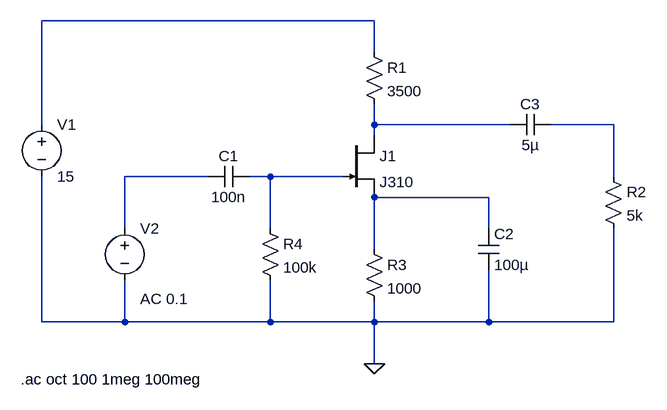
[diagram p0: schematic NJ.asc]
NJ.asc, the LTspice schematic file:
Version 4.1
SHEET 1 880 680
WIRE 240 -16 -272 -16
WIRE 240 32 240 -16
WIRE -272 144 -272 -16
WIRE 240 144 240 112
WIRE 448 144 240 144
WIRE 608 144 512 144
WIRE 240 160 240 144
WIRE -16 224 -144 224
WIRE 80 224 48 224
WIRE 192 224 80 224
WIRE 608 224 608 144
WIRE 416 256 240 256
WIRE -144 304 -144 224
WIRE 80 304 80 224
WIRE 416 304 416 256
WIRE 240 336 240 256
WIRE -272 448 -272 224
WIRE -144 448 -144 384
WIRE -144 448 -272 448
WIRE 80 448 80 384
WIRE 80 448 -144 448
WIRE 240 448 240 416
WIRE 240 448 80 448
WIRE 416 448 416 368
WIRE 416 448 240 448
WIRE 608 448 608 304
WIRE 608 448 416 448
WIRE 240 512 240 448
FLAG 240 512 0
SYMBOL res 224 16 R0
SYMATTR InstName R1
SYMATTR Value 3500
SYMBOL res 592 208 R0
SYMATTR InstName R2
SYMATTR Value 5k
SYMBOL res 224 320 R0
SYMATTR InstName R3
SYMATTR Value 1000
SYMBOL res 64 288 R0
SYMATTR InstName R4
SYMATTR Value 100k
SYMBOL voltage -272 128 R0
WINDOW 123 0 0 Left 0
WINDOW 39 0 0 Left 0
SYMATTR InstName V1
SYMATTR Value 15
SYMBOL voltage -144 288 R0
WINDOW 123 24 124 Left 2
WINDOW 39 0 0 Left 0
SYMATTR InstName V2
SYMATTR Value ""
SYMATTR Value2 AC 0.1
SYMBOL cap 48 208 R90
WINDOW 0 0 32 VBottom 2
WINDOW 3 32 32 VTop 2
SYMATTR InstName C1
SYMATTR Value 100n
SYMBOL cap 400 304 R0
SYMATTR InstName C2
SYMATTR Value 100µ
SYMBOL cap 512 128 R90
WINDOW 0 0 32 VBottom 2
WINDOW 3 32 32 VTop 2
SYMATTR InstName C3
SYMATTR Value 5µ
SYMBOL njf 192 160 R0
SYMATTR InstName J1
SYMATTR Value J310
TEXT -304 536 Left 2 !.ac oct 100 1meg 100meg

The netlist it stands for:
* NJ.asc
R1 N001 N002 3500
R2 N003 0 5k
R3 N006 0 1000
R4 N005 0 100k
V1 N001 0 15
V2 N004 0 AC 0.1
C1 N005 N004 100n
C2 N006 0 100µ
C3 N003 N002 5µ
J1 N002 N005 N006 J310
.model NJF NJF
.model PJF PJF
.lib standard.jft
.ac oct 100 1meg 100meg
.backanno
.end